# EasyEDA Pro project ProProject_Access Control Core_2024-06-07.epro, schematic V2.2.1 Schematic

## Sheets
1 Microcontroller: Create Date: 2024-05-24; Page Name: Microcontroller; Project Name: Access Control Core; Schematic Name: V2.2.1 Schematic; Update Date: 2024-06-07; Company: RIT SHED MAKERSPACE; Drawn: Jim Heaney; Page Size: A4; Part Number: JLCPCB-002; Reviewed: Jim Heaney; Version: V0.1
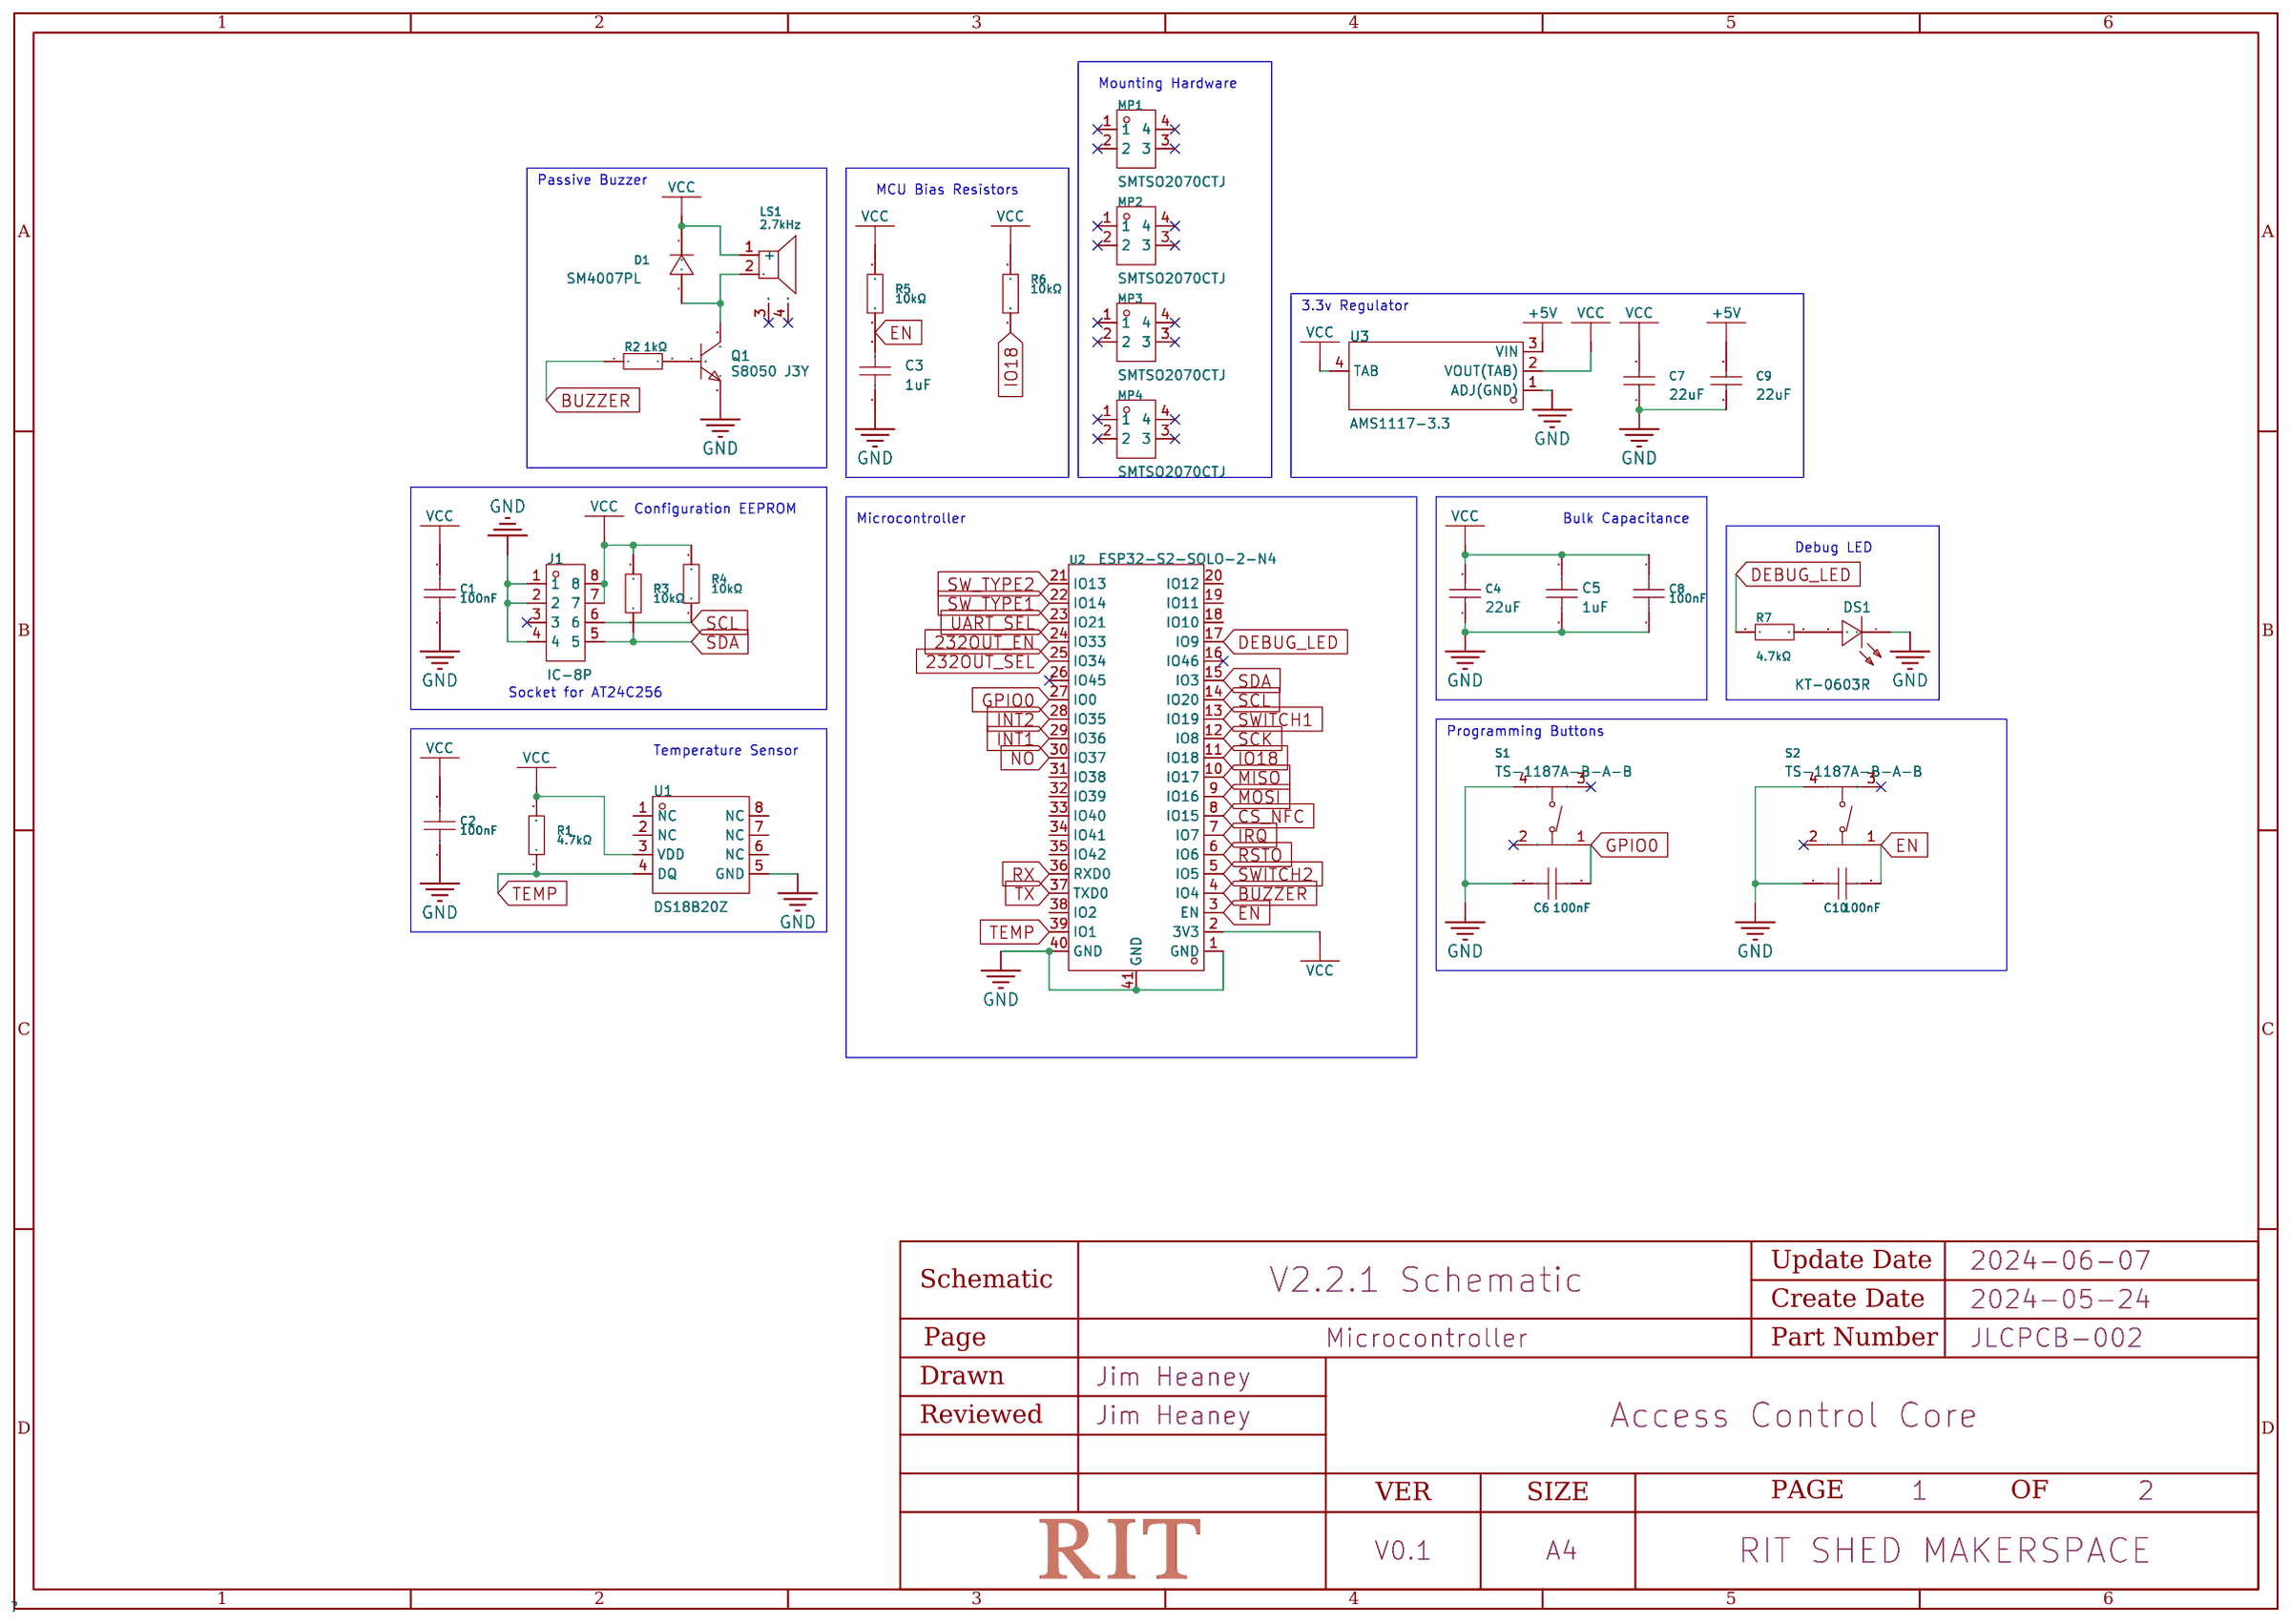
[diagram p7: Microcontroller]
2 Interface: Page Name: Interface
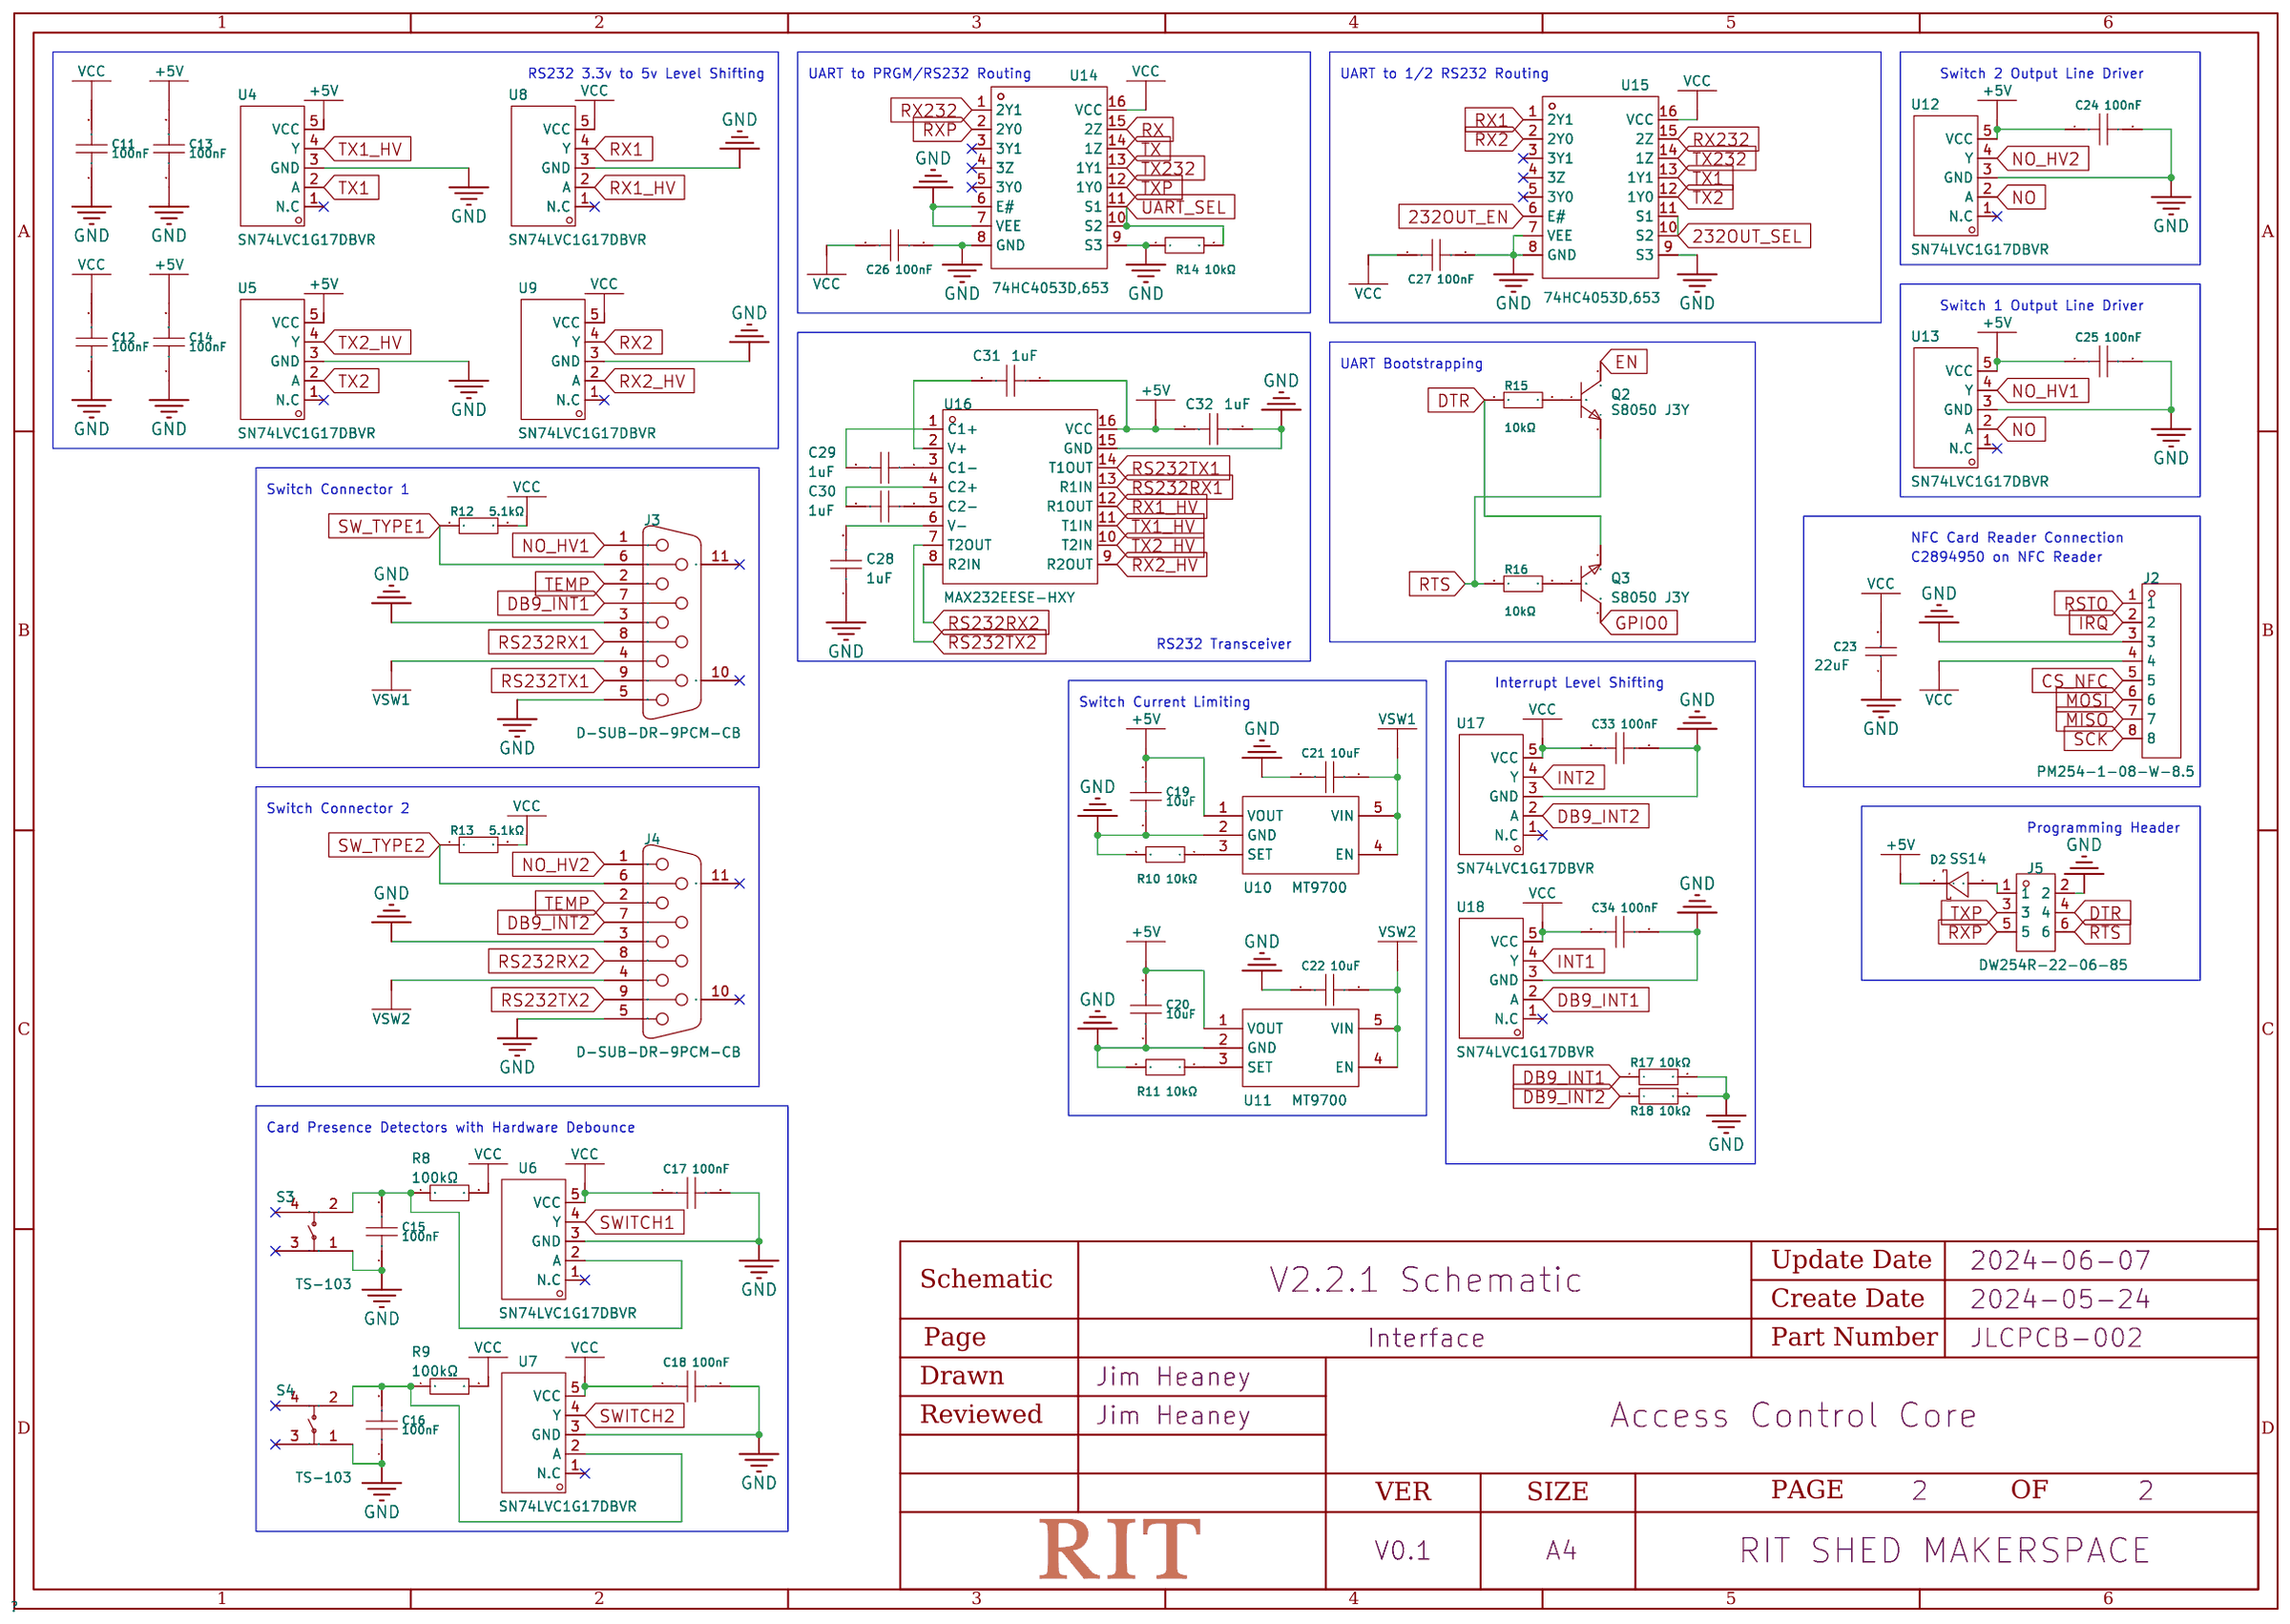
[diagram p8: Interface]

## Parts
sheet Interface
C11  100nF  [C0603]
C12  100nF  [C0603]
C13  100nF  [C0603]
C14  100nF  [C0603]
C15  100nF  [C0603]
C16  100nF  [C0603]
C17  100nF  [C0603]
C18  100nF  [C0603]
C19  10uF  [C0603]
C20  10uF  [C0603]
C21  10uF  [C0603]
C22  10uF  [C0603]
C23  22uF  [C1206]
C24  100nF  [C0603]
C25  100nF  [C0603]
C26  100nF  [C0603]
C27  100nF  [C0603]
C28  1uF  [C0603]
C29  1uF  [C0603]
C30  1uF  [C0603]
C31  1uF  [C0603]
C32  1uF  [C0603]
C33  100nF  [C0603]
C34  100nF  [C0603]
D2  SS14  [SMA_L4.2-W2.6-LS5.3-RD]
J2  PM254-1-08-W-8.5  [HDR-TH_8P-P2.54-H-F-W10.0-N]
J3  D-SUB-DR-9PCM-CB  [DB9-TH_ID09S33E4GV00LF]
J4  D-SUB-DR-9PCM-CB  [DB9-TH_ID09S33E4GV00LF]
J5  DW254R-22-06-85  [HDR-TH_6P-P2.54-V-F-R2-C3-S2.54]
Q2  S8050 J3Y  [SOT-23-3_L3.0-W1.7-P0.95-LS2.9-BR]
Q3  S8050 J3Y  [SOT-23-3_L3.0-W1.7-P0.95-LS2.9-BR]
R8  100kΩ  [R0603]
R9  100kΩ  [R0603]
R10  10kΩ  [R0603]
R11  10kΩ  [R0603]
R12  5.1kΩ  [R0603]
R13  5.1kΩ  [R0603]
R14  10kΩ  [R0603]
R15  10kΩ  [R0603]
R16  10kΩ  [R0603]
R17  10kΩ  [R0603]
R18  10kΩ  [R0603]
S3  TS-103  [SW-SMD_TS-103]
S4  TS-103  [SW-SMD_TS-103]
U4  SN74LVC1G17DBVR  [SOT-23-5_L3.0-W1.7-P0.95-LS2.8-BR]
U5  SN74LVC1G17DBVR  [SOT-23-5_L3.0-W1.7-P0.95-LS2.8-BR]
U6  SN74LVC1G17DBVR  [SOT-23-5_L3.0-W1.7-P0.95-LS2.8-BR]
U7  SN74LVC1G17DBVR  [SOT-23-5_L3.0-W1.7-P0.95-LS2.8-BR]
U8  SN74LVC1G17DBVR  [SOT-23-5_L3.0-W1.7-P0.95-LS2.8-BR]
U9  SN74LVC1G17DBVR  [SOT-23-5_L3.0-W1.7-P0.95-LS2.8-BR]
U10  MT9700  [SOT-23-5_L3.0-W1.7-P0.95-LS2.8-BR]
U11  MT9700  [SOT-23-5_L3.0-W1.7-P0.95-LS2.8-BR]
U12  SN74LVC1G17DBVR  [SOT-23-5_L3.0-W1.7-P0.95-LS2.8-BR]
U13  SN74LVC1G17DBVR  [SOT-23-5_L3.0-W1.7-P0.95-LS2.8-BR]
U14  74HC4053D,653  [SOIC-16_L9.9-W3.9-P1.27-LS6.0-BL]
U15  74HC4053D,653  [SOIC-16_L9.9-W3.9-P1.27-LS6.0-BL]
U16  MAX232EESE-HXY  [SOP-16_L9.9-W3.9-P1.27-LS6.0-BL]
U17  SN74LVC1G17DBVR  [SOT-23-5_L3.0-W1.7-P0.95-LS2.8-BR]
U18  SN74LVC1G17DBVR  [SOT-23-5_L3.0-W1.7-P0.95-LS2.8-BR]
sheet Microcontroller
C1  100nF  [C0603]
C2  100nF  [C0603]
C3  1uF  [C0603]
C4  22uF  [C1206]
C5  1uF  [C0603]
C6  100nF  [C0603]
C7  22uF  [C1206]
C8  100nF  [C0603]
C9  22uF  [C1206]
C10  100nF  [C0603]
D1  SM4007PL  [SOD-123F_L2.8-W1.8-LS3.7-RD]
DS1  KT-0603R  [LED0603-RD]
J1  IC-8P  [DIP-8_L10.2-W10.1-P2.54-LS7.6-BL]
LS1  2.7kHz  [BUZ-SMD_4P-L8.5-W8.5-P8.50-TL]
MP1  SMTSO2070CTJ  [SMD_BD5.6-L5.6-W5.6-D3.6]
MP2  SMTSO2070CTJ  [SMD_BD5.6-L5.6-W5.6-D3.6]
MP3  SMTSO2070CTJ  [SMD_BD5.6-L5.6-W5.6-D3.6]
MP4  SMTSO2070CTJ  [SMD_BD5.6-L5.6-W5.6-D3.6]
Q1  S8050 J3Y  [SOT-23-3_L3.0-W1.7-P0.95-LS2.9-BR]
R1  4.7kΩ  [R0603]
R2  1kΩ  [R0603]
R3  10kΩ  [R0603]
R4  10kΩ  [R0603]
R5  10kΩ  [R0603]
R6  10kΩ  [R0603]
R7  4.7kΩ  [R0603]
S1  TS-1187A-B-A-B  [SW-SMD_4P-L5.1-W5.1-P3.70-LS6.5-TL-2]
S2  TS-1187A-B-A-B  [SW-SMD_4P-L5.1-W5.1-P3.70-LS6.5-TL-2]
U1  DS18B20Z  [SOP-8_L4.9-W3.9-P1.27-LS6.0-BL]
U2  2.4GHz  [WIRELM-SMD_ESP32-S3-WROOM-1]
U3  AMS1117-3.3  [SOT-223-4_L6.5-W3.5-P2.30-LS7.0-BR]

## Library data of the parts
C1 C2 C6 C8 C10-C18 C24-C27 C33 C34 = CC0603KRX7R9BB104: Capacitance: Tolerance:±10% Tolerance:±10% Voltage Rated: Temperature Coefficient:; LCSC Part Name: 100nF ±10% 50V; Supplier Part: C14663; Manufacturer: YAGEO(国巨); Supplier Footprint: 0603; JLCPCB Part Class: Basic Part; Datasheet: https://atta.szlcsc.com/upload/public/pdf/source/20180910/C282072_33301C7F631E79921B82A8DAC6BCC5B3.pdf; Supplier: LCSC; Tolerance: ±10%
C19-C22 = CL10A106MA8NRNC: Capacitance: Tolerance:±20% Tolerance:±20% Voltage Rated: Temperature Coefficient:; LCSC Part Name: 10uF ±20% 25V; Supplier Part: C96446; Manufacturer: SAMSUNG(三星); Supplier Footprint: 0603; JLCPCB Part Class: Basic Part; Datasheet: https://atta.szlcsc.com/upload/public/pdf/source/20160218/1457707763339.pdf; Supplier: LCSC; Tolerance: ±20%
C4 C7 C9 C23 = CL31A226KAHNNNE: Capacitance: Tolerance:±10% Tolerance:±10% Voltage Rated: Temperature Coefficient:; LCSC Part Name: 22uF ±10% 25V; Supplier Part: C12891; Manufacturer: SAMSUNG(三星); Supplier Footprint: 1206; JLCPCB Part Class: Basic Part; Datasheet: https://atta.szlcsc.com/upload/public/pdf/source/20160218/1457707763339.pdf; Supplier: LCSC; Tolerance: ±10%
C3 C5 C28-C32 = CL10A105KB8NNNC: Capacitance: Tolerance:±10% Tolerance:±10% Voltage Rated: Temperature Coefficient:; LCSC Part Name: 1uF ±10% 50V; Supplier Part: C15849; Manufacturer: SAMSUNG(三星); Supplier Footprint: 0603; JLCPCB Part Class: Basic Part; Datasheet: https://atta.szlcsc.com/upload/public/pdf/source/20160218/1457707763339.pdf; Supplier: LCSC; Tolerance: ±10%
D2 = SS14_C2480: Diode Configuration:Single Forward Voltage (Vf@If):550mV@1A Reverse Voltage (Vr):40V Average Rectified Current (Io):1A Reverse Leakage Current (Ir):500uA@40V; LCSC Part Name: 电压:40V 电流:1A; Supplier Part: C2480; Manufacturer: MDD; Supplier Footprint: SMA(DO-214AC); JLCPCB Part Class: Basic Part; Datasheet: https://atta.szlcsc.com/upload/public/pdf/source/20230712/2DB6064CFBB99DE6DB116BEE8208BE66.pdf; Supplier: LCSC; Diode Configuration: Single; Forward Voltage (Vf@If): 550mV@1A; Reverse Voltage (Vr): 40V; Average Rectified Current (Io): 1A; Reverse Leakage Current (Ir): 500uA@40V
J2 = PM254-1-08-W-8.5: Holes Structure:1x8P Pitch:2.54mm Row Spacing:- Circular Hole / Square Hole:Square Holes Mounting Type:Right-Angle Number of Rows:Plugin Number of Holes:8P Current Rating (Max):3A Voltage Rating (Max):- Holes Direction:side Insulation Height:8.5mm Contact; LCSC Part Name: 1x8P 间距:2.54mm 弯插; Supplier Part: C2897390; Manufacturer: HCTL(华灿天禄); Supplier Footprint: 弯插,P=2.54mm; JLCPCB Part Class: Extended Part; Datasheet: https://atta.szlcsc.com/upload/public/pdf/source/20230609/7BA40A3D721268A082DCDEAD4C99131B.pdf; Supplier: LCSC; Holes Structure: 1x8P; Pitch: 2.54mm; Circular Hole / Square Hole: Square Holes; Mounting Type: Right-Angle; Number of Rows: Plugin; Number of Holes: 8P; Current Rating (Max): 3A; Holes Direction: side; Insulation Height: 8.5mm; Contact Material: Copper Alloy; Operating Temperature Range: -40℃~+105℃; Soldering Temperature(Max): 260℃@5S
J3 J4 = D-SUB-DR-9PCM-CB: Connector Type:D-Sub Gender:Female Number of Pins:9P Mounting Style:Right-Angle Number of Rows:2 Current Rating (Max):3A Contact Plating:Tin Operating Temperature Range:-50℃~+105℃ Operating Temperature Range:-50℃~+105℃; LCSC Part Name: D-Sub 母 P数:9P; Supplier Part: C19077337; Manufacturer: XUNPU(讯普); Supplier Footprint: 弯插; JLCPCB Part Class: Extended Part; Datasheet: https://atta.szlcsc.com/upload/public/pdf/source/20231108/FB2E8AB0BE4F620DDF3F7F4D0B9AFB97.pdf; Supplier: LCSC; Connector Type: D-Sub; Gender: Female; Number of Pins: 9P; Mounting Style: Right-Angle; Number of Rows: 2; Current Rating (Max): 3A; Contact Plating: Tin; Operating Temperature Range: -50℃~+105℃
J5 = DW254R-22-06-85: Holes Structure:2x3P Pitch:2.54mm Row Spacing:2.54mm Circular Hole / Square Hole:Square Holes Mounting Type:Straight Number of Rows:双排 Number of Holes:6P Current Rating (Max):3A Voltage Rating (Max):- Holes Direction:Top Insulation Height:8.5mm Operating; LCSC Part Name: 间距:2.54mm 2x3P 直插; Supplier Part: C2935983; Manufacturer: DEALON(德艺隆); Supplier Footprint: 插件,P=2.54mm; JLCPCB Part Class: Extended Part; Datasheet: https://atta.szlcsc.com/upload/public/pdf/source/20211231/BFA45F732C9356EE88FA0C9F09D83196.pdf; Supplier: LCSC; Holes Structure: 2x3P; Pitch: 2.54mm; Row Spacing: 2.54mm; Circular Hole / Square Hole: Square Holes; Mounting Type: Straight; Number of Rows: 双排; Number of Holes: 6P; Current Rating (Max): 3A; Holes Direction: Top; Insulation Height: 8.5mm
Q1-Q3 = S8050 J3Y_C2146: Transistor Type: Collector Current (Ic): Collector-Emitter Breakdown Voltage (Vceo): Power Dissipation (Pd): DC Current Gain (hFE@Ic,Vce):200@50mA,1V DC Current Gain (hFE@Ic,Vce):200@50mA,1V Transition Frequency (fT):150MHz Collector Cut-Off Current (Icbo; LCSC Part Name: S8050 J3Y(RANGE:200-350) H档(200-350); Supplier Part: C2146; Manufacturer: CJ(江苏长电/长晶); Supplier Footprint: SOT-23; JLCPCB Part Class: Basic Part; Datasheet: https://atta.szlcsc.com/upload/public/pdf/source/20140809/1457707209234.pdf; Supplier: LCSC; DC Current Gain (hFE@Ic,Vce): 200@50mA,1V; Transition Frequency (fT): 150MHz; Collector Cut-Off Current (Icbo): 100nA; Collector-Emitter Saturation Voltage (VCE(sat)@Ic,Ib): 600mV@500mA,50mA
R8 R9 = 0603WAF1003T5E: Type:Thick Film Resistors Resistance:100kΩ Tolerance:±1% Tolerance:±1% Power(Watts): Overload Voltage (Max): Temperature Coefficient:±100ppm/℃ Temperature Coefficient:±100ppm/℃ Operating Temperature Range:-55℃~+155℃ Operating Temperature Range:-55℃~+155℃; LCSC Part Name: 100kΩ ±1% 100mW 厚膜电阻; Supplier Part: C25803; Manufacturer: UNI-ROYAL(厚声); Supplier Footprint: 0603; JLCPCB Part Class: Basic Part; Datasheet: https://atta.szlcsc.com/upload/public/pdf/source/20200306/C422600_1E6D84923E4A46A82E41ADD87F860B5C.pdf; Supplier: LCSC; Type: Thick Film Resistors; Tolerance: ±1%; Temperature Coefficient: ±100ppm/℃; Operating Temperature Range: -55℃~+155℃
R3-R6 R10 R11 R14-R18 = 0603WAF1002T5E: Type:Thick Film Resistors Resistance:10kΩ Tolerance:±1% Tolerance:±1% Power(Watts): Overload Voltage (Max): Temperature Coefficient:±100ppm/℃ Temperature Coefficient:±100ppm/℃ Operating Temperature Range:-55℃~+155℃ Operating Temperature Range:-55℃~+155℃; LCSC Part Name: 厚膜电阻 10kΩ ±1% 100mW; Supplier Part: C25804; Manufacturer: UNI-ROYAL(厚声); Supplier Footprint: 0603; JLCPCB Part Class: Basic Part; Datasheet: https://atta.szlcsc.com/upload/public/pdf/source/20200306/C422600_1E6D84923E4A46A82E41ADD87F860B5C.pdf; Supplier: LCSC; Type: Thick Film Resistors; Tolerance: ±1%; Temperature Coefficient: ±100ppm/℃; Operating Temperature Range: -55℃~+155℃
R12 R13 = 0603WAF5101T5E: Type:Thick Film Resistors Resistance:5.1kΩ Tolerance:±1% Tolerance:±1% Power(Watts): Overload Voltage (Max): Temperature Coefficient:±100ppm/℃ Temperature Coefficient:±100ppm/℃ Operating Temperature Range:-55℃~+155℃ Operating Temperature Range:-55℃~+155℃; LCSC Part Name: 5.1kΩ ±1% 100mW 厚膜电阻; Supplier Part: C23186; Manufacturer: UNI-ROYAL(厚声); Supplier Footprint: 0603; JLCPCB Part Class: Basic Part; Datasheet: https://atta.szlcsc.com/upload/public/pdf/source/20200306/C422600_1E6D84923E4A46A82E41ADD87F860B5C.pdf; Supplier: LCSC; Type: Thick Film Resistors; Tolerance: ±1%; Temperature Coefficient: ±100ppm/℃; Operating Temperature Range: -55℃~+155℃
S3 S4 = TS-103: Type:Micro Switch Circuit:SPST Actuator Style:Corner flick Switch Length:4.75mm Switch Width:3.6mm Switch Height:3.75mm Contact Current (DC):50mA Voltage Rating (DC):12V Contact Current (AC):- Voltage Rating (AC):- Mechanical Life:10万次 Pin Style:- Operati; LCSC Part Name: 4.75*3.6*3.75mm 贴片微动开关; Supplier Part: C668592; Manufacturer: SHOU HAN(首韩); Supplier Footprint: SMD; JLCPCB Part Class: Extended Part; Datasheet: https://atta.szlcsc.com/upload/public/pdf/source/20200618/C668592_56C85AAF79E541D110C869AD77F2B956.pdf; Supplier: LCSC; Type: Micro Switch; Circuit: SPST; Actuator Style: Corner flick; Switch Length: 4.75mm; Switch Width: 3.6mm; Switch Height: 3.75mm; Contact Current (DC): 50mA; Voltage Rating (DC): 12V; Mechanical Life: 10万次; Operating Temperature: -30℃~+85℃
U4-U9 U12 U13 U17 U18 = SN74LVC1G17DBVR: Input type:Schmitt Trigger output type:推挽 Supply Voltage:1.65V~5.5V Supply Voltage:1.65V~5.5V Number of Elements:1 Number of Bits per Element:1 Sink Current:32mA Source Current:32mA Logic Family:74LVC Operating Temperature:-40℃~+125℃ Operating Temperature; Supplier Part: C7836; Manufacturer: TI(德州仪器); Supplier Footprint: SOT-23-5; JLCPCB Part Class: Extended Part; Datasheet: https://www.ti.com/cn/lit/gpn/sn74lvc1g17; Supplier: LCSC; Input type: Schmitt Trigger; output type: 推挽; Supply Voltage: 1.65V~5.5V; Number of Elements: 1; Number of Bits per Element: 1; Sink Current: 32mA; Source Current: 32mA; Logic Family: 74LVC; Operating Temperature: -40℃~+125℃
U10 U11 = MT9700: Supplier Part: C89855; Manufacturer: 西安航天民芯; Supplier Footprint: SOT-23-5; JLCPCB Part Class: Extended Part; Datasheet: https://atta.szlcsc.com/upload/public/pdf/source/20170418/1492481333031.pdf; Supplier: LCSC
U14 U15 = 74HC4053D,653: Switch Circuit:SPDT(SPDT) Number of Channels:3 Supply Voltage:2V~10V Supply Voltage:2V~10V Turn-on time:31ns On-State Resistance (Max):120Ω Turn-off time:29ns; Supplier Part: C5647; Manufacturer: Nexperia(安世); Supplier Footprint: SOIC-16; JLCPCB Part Class: Extended Part; Datasheet: https://atta.szlcsc.com/upload/public/pdf/source/20170918/C131090_1505726845374976183.pdf; Supplier: LCSC; Switch Circuit: SPDT(SPDT); Number of Channels: 3; Supply Voltage: 2V~10V; Turn-on time: 31ns; On-State Resistance (Max): 120Ω; Turn-off time: 29ns
U16 = MAX232EESE-HXY: Driver/receiver:2/2 Data Rate:120Kbps Data Rate:120Kbps Supply Voltage:5V Supply Voltage:5V; Supplier Part: C19626971; Manufacturer: HXY MOSFET(华轩阳电子); Supplier Footprint: SOP-16; JLCPCB Part Class: Extended Part; Datasheet: https://atta.szlcsc.com/upload/public/pdf/source/20231215/08C47B9710D348E23143C3CE5F7DFFF8.pdf; Supplier: LCSC; Driver/receiver: 2/2; Data Rate: 120Kbps; Supply Voltage: 5V
D1 = SM4007PL_C64898: Diode Configuration: Forward Voltage (Vf@If):1.1V@1A Reverse Voltage (Vr): Average Rectified Current (Io): Reverse Leakage Current:10uA@1kV; LCSC Part Name: 电压:1kV 电流:1A; Supplier Part: C64898; Manufacturer: MDD; Supplier Footprint: SOD-123FL; JLCPCB Part Class: Basic Part; Datasheet: https://atta.szlcsc.com/upload/public/pdf/source/20230823/16A8FDE162764C9B685A3717F2DA3690.pdf; Supplier: LCSC; Forward Voltage (Vf@If): 1.1V@1A; Reverse Leakage Current: 10uA@1kV
DS1 = KT-0603R: Emitted Color:Red Power Dissipation:- Forward Current:- Dominant Wavelength:- Dominant Wavelength:- Peak Wavelength:- Diode Configuration:- Lens Color:- Color Temperature:- Color Temperature:- Viewing Angle:- Mounting Sytle:- Operating Temperature:-40℃~+8; LCSC Part Name: 0603 红灯 高亮; Supplier Part: C2286; Manufacturer: KENTO; Supplier Footprint: 0603; JLCPCB Part Class: Basic Part; Datasheet: https://atta.szlcsc.com/upload/public/pdf/source/20160616/1466072038404.pdf; Supplier: LCSC; Emitted Color: Red; Operating Temperature: -40℃~+85℃
J1 = IC-8P: Number of Positions:8P; LCSC Part Name: P数:8P; Supplier Part: C5289485; Manufacturer: ZHOURI(洲日); Supplier Footprint: DIP-8; JLCPCB Part Class: Extended Part; Datasheet: https://atta.szlcsc.com/upload/public/pdf/source/20221125/3E83BD656FA58AC4D44626E20A8B2E8F.pdf; Supplier: LCSC; Number of Positions: 8P
LS1 = MLT-8540: Oscillator Circuit:无源(外部驱动) Technology Type:电磁式 Operating Voltage:2.5V~4.5V Operating Voltage:2.5V~4.5V Frequency:2.7kHz Current Consumption:- Sound Pressure Level (SPL):80dB@5V,10cm Diameter (φD):- Length:8.7mm Width:8.7mm Height:4mm Operating Temperatur; Supplier Part: C95300; Manufacturer: 华能; Supplier Footprint: SMD,8.7x8.7mm; JLCPCB Part Class: Extended Part; Datasheet: https://atta.szlcsc.com/upload/public/pdf/source/20170522/1495448323732.pdf; Supplier: LCSC; Oscillator Circuit: 无源(外部驱动); Technology Type: 电磁式; Operating Voltage: 2.5V~4.5V; Sound Pressure Level (SPL): 80dB@5V,10cm; Length: 8.7mm; Width: 8.7mm; Height: 4mm
MP1-MP4 = SMTSO2070CTJ: specifications:M2X7 surface treatment:镀锡 Product Description:- material quality:- model:SMTSO2070CTJ brand:Sinhoo(雄和远景); LCSC Part Name: 雄和远景，电路板表贴圆螺母柱，M2X7，铜镀锡,1个; Supplier Part: C2916355; Manufacturer: Sinhoo(雄和远景); JLCPCB Part Class: Extended Part; Datasheet: https://atta.szlcsc.com/upload/public/pdf/source/20211122/17CF5E24EB4D4DC090A80DE3D7DE5E21.pdf; Supplier: LCSC; specifications: M2X7; surface treatment: 镀锡; brand: Sinhoo(雄和远景)
R1 R7 = 0603WAF4701T5E: Type:Thick Film Resistors Resistance:4.7kΩ Tolerance:±1% Tolerance:±1% Power(Watts): Overload Voltage (Max): Temperature Coefficient:±100ppm/℃ Temperature Coefficient:±100ppm/℃ Operating Temperature Range:-55℃~+155℃ Operating Temperature Range:-55℃~+155℃; LCSC Part Name: 4.7kΩ ±1% 100mW 厚膜电阻; Supplier Part: C23162; Manufacturer: UNI-ROYAL(厚声); Supplier Footprint: 0603; JLCPCB Part Class: Basic Part; Datasheet: https://atta.szlcsc.com/upload/public/pdf/source/20200306/C422600_1E6D84923E4A46A82E41ADD87F860B5C.pdf; Supplier: LCSC; Type: Thick Film Resistors; Tolerance: ±1%; Temperature Coefficient: ±100ppm/℃; Operating Temperature Range: -55℃~+155℃
R2 = 0603WAF1001T5E: Type:Thick Film Resistors Resistance:1kΩ Tolerance:±1% Tolerance:±1% Power(Watts): Overload Voltage (Max): Temperature Coefficient:±100ppm/℃ Temperature Coefficient:±100ppm/℃ Operating Temperature Range:-55℃~+155℃ Operating Temperature Range:-55℃~+155℃; LCSC Part Name: 1kΩ ±1% 100mW 厚膜电阻; Supplier Part: C21190; Manufacturer: UNI-ROYAL(厚声); Supplier Footprint: 0603; JLCPCB Part Class: Basic Part; Datasheet: https://atta.szlcsc.com/upload/public/pdf/source/20200306/C422600_1E6D84923E4A46A82E41ADD87F860B5C.pdf; Supplier: LCSC; Type: Thick Film Resistors; Tolerance: ±1%; Temperature Coefficient: ±100ppm/℃; Operating Temperature Range: -55℃~+155℃
S1 S2 = TS-1187A-B-A-B: Circuit:SPST Actuator Style:Round Button Operating Force:160gf Mounting Style:Brick nogging Switch Length:5.1mm Switch Width:5.1mm Switch Height:1.5mm Strike Gundam:不带 Contact Current:50mA Voltage Rating (DC):12V Insulation Resistance:- Actuator/Cap Color; LCSC Part Name: 5.1*5.1*1.5mm 立贴 轻触开关; Supplier Part: C318884; Manufacturer: XKB Connectivity(中国星坤); Supplier Footprint: SMD; JLCPCB Part Class: Basic Part; Datasheet: https://atta.szlcsc.com/upload/public/pdf/source/20200227/C318890_053E50208A88A7BA1965D8746000774E.pdf; Supplier: LCSC; Circuit: SPST; Actuator Style: Round Button; Operating Force: 160gf; Mounting Style: Brick nogging; Switch Length: 5.1mm; Switch Width: 5.1mm; Switch Height: 1.5mm; Strike Gundam: 不带; Contact Current: 50mA; Voltage Rating (DC): 12V; Actuator/Cap Color: 金色; With Lamp: No; Mechanical Life: 10万次; Operating Temperature: -30℃~+85℃
U1 = DS18B20Z: Resolution:±0.4℃ Resolution:±0.4℃ Supply Voltage:2.5V~5.5V Supply Voltage:2.5V~5.5V; LCSC Part Name: 温度传感器; Supplier Part: C695837; Manufacturer: UMW(友台半导体); Supplier Footprint: SOIC-8; JLCPCB Part Class: Extended Part; Datasheet: https://atta.szlcsc.com/upload/public/pdf/source/20231109/DC3DA9D47D486EF40A6E0F08B9A498E3.pdf; Supplier: LCSC; Resolution: ±0.4℃; Supply Voltage: 2.5V~5.5V
U2 = ESP32-S2-SOLO-2-N4: Core Processor:ESP32-S2芯片 Support Interface:I2C；GPIO；SPI；PWM；ADC；UART；USB；I2S Frequency:2.4GHz Output Power:19.5dBm Output Power:19.5dBm; Supplier Part: C3040594; Manufacturer: ESPRESSIF(乐鑫); Supplier Footprint: SMD-41P; JLCPCB Part Class: Extended Part; Datasheet: https://atta.szlcsc.com/upload/public/pdf/source/20220829/68E69EF550BFD22B9418B9E05FF4E453.pdf; Supplier: LCSC; Core Processor: ESP32-S2芯片; Support Interface: I2C；GPIO；SPI；PWM；ADC；UART；USB；I2S; Output Power: 19.5dBm
U3 = AMS1117-3.3_C347222: Output Type: Maximum Input Voltage:12V Output Voltage:3.3V Output Voltage:3.3V MAX Output Current:1A Power Supply Rejection Ratio (PSRR):60dB@(120Hz) Dropout Voltage:1.3V@(1A) standby current:- Noise:- Feature:- Operating Temperature:- Operating Temperatu; LCSC Part Name: 输出:3.3V 电流:1A 耐压:12V; Supplier Part: C347222; Manufacturer: UMW(友台半导体); Supplier Footprint: SOT-223; JLCPCB Part Class: Extended Part; Datasheet: https://atta.szlcsc.com/upload/public/pdf/source/20231109/155D79A26D9DB04352555A58D5969DC8.pdf; Supplier: LCSC; Maximum Input Voltage: 12V; Output Voltage: 3.3V; MAX Output Current: 1A; Power Supply Rejection Ratio (PSRR): 60dB@(120Hz); Dropout Voltage: 1.3V@(1A); Output Polarity: Positive electrode; Number of Outputs: 1

## Nets
+5V: C9.2 C13.2 C14.2 C19.2 C20.2 C24.1 C25.1 C31.1 C32.2 D2.1(K) U3.3(VIN) U4.5(VCC) U5.5(VCC) U10.1(VOUT) U11.1(VOUT) U12.5(VCC) U13.5(VCC) U16.16(VCC)
GND: C1.1 C2.1 C3.1 C4.1 C5.1 C6.1 C7.1 C8.1 C9.1 C10.1 C11.1 C12.1 C13.1 C14.1 C15.1 C16.1 C17.2 C18.2 C19.1 C20.1 C21.2 C22.2 C23.1 C24.2 C25.2 C26.2 C27.2 C28.1 C32.1 C33.1 C34.1 DS1.1(K) J1.1 J1.2 J1.4 J2.3 J3.3 J3.5 J4.3 J4.5 J5.2 Q1.2(E) R10.2 R11.2 R14.1 R17.2 R18.2 S1.4(D) S2.4(D) S3.1 S4.1 U1.5(GND) U2.1(GND) U2.40(GND) U2.41(GND) U3.1(ADJ(GND)) U4.3(GND) U5.3(GND) U6.3(GND) U7.3(GND) U8.3(GND) U9.3(GND) U10.2(GND) U11.2(GND) U12.3(GND) U13.3(GND) U14.6(E#) U14.7(VEE) U14.8(GND) U14.9(S3) U15.7(VEE) U15.8(GND) U15.9(S3) U16.15(GND) U17.3(GND) U18.3(GND)
VCC: C1.2 C2.2 C4.2 C5.2 C7.2 C8.2 C11.2 C12.2 C17.1 C18.1 C23.2 C26.1 C27.1 C33.2 C34.2 D1.1(C) J1.7 J1.8 J2.4 LS1.1(+) R1.2 R3.2 R4.2 R5.2 R6.2 R8.2 R9.2 R12.2 R13.2 U1.3(VDD) U2.2(3V3) U3.2(VOUT(TAB)) U3.4(TAB) U6.5(VCC) U7.5(VCC) U8.5(VCC) U9.5(VCC) U14.16(VCC) U15.16(VCC) U17.5(VCC) U18.5(VCC)
232OUT_EN: U2.24(IO33) U15.6(E#)
232OUT_SEL: U2.25(IO34) U15.10(S2) U15.11(S1)
BUZZER: R2.1 U2.4(IO4)
CS_NFC: J2.5 U2.8(IO15)
DB9_INT1: J3.7 R17.1 U18.2(A)
DB9_INT2: J4.7 R18.1 U17.2(A)
DEBUG_LED: R7.2 U2.17(IO9)
DTR: J5.4 Q3.2(E) R15.1
EN: C3.2 C10.2 Q2.3(C) R5.1 S2.1(A) U2.3(EN)
GPIO0: C6.2 Q3.3(C) S1.1(A) U2.27(IO0)
INT1: U2.29(IO36) U18.4(Y)
INT2: U2.28(IO35) U17.4(Y)
IO18: R6.1 U2.11(IO18)
IRQ: J2.2 U2.7(IO7)
MISO: J2.7 U2.10(IO17)
MOSI: J2.6 U2.9(IO16)
NO: U2.30(IO37) U12.2(A) U13.2(A)
NO_HV1: J3.1 U13.4(Y)
NO_HV2: J4.1 U12.4(Y)
RS232RX1: J3.8 U16.13(R1IN)
RS232RX2: J4.8 U16.8(R2IN)
RS232TX1: J3.9 U16.14(T1OUT)
RS232TX2: J4.9 U16.7(T2OUT)
RSTO: J2.1 U2.6(IO6)
RTS: J5.6 Q2.2(E) R16.1
RX: U2.36(RXD0) U14.15(2Z)
RX1: U8.4(Y) U15.1(2Y1)
RX1_HV: U8.2(A) U16.12(R1OUT)
RX2: U9.4(Y) U15.2(2Y0)
RX2_HV: U9.2(A) U16.9(R2OUT)
RX232: U14.1(2Y1) U15.15(2Z)
RXP: J5.5 U14.2(2Y0)
SCK: J2.8 U2.12(IO8)
SCL: J1.6 R4.1 U2.14(IO20)
SDA: J1.5 R3.1 U2.15(IO3)
SW_TYPE1: J3.6 R12.1 U2.22(IO14)
SW_TYPE2: J4.6 R13.1 U2.21(IO13)
SWITCH1: U2.13(IO19) U6.4(Y)
SWITCH2: U2.5(IO5) U7.4(Y)
TEMP: J3.2 J4.2 R1.1 U1.4(DQ) U2.39(IO1)
TX: U2.37(TXD0) U14.14(1Z)
TX1: U4.2(A) U15.13(1Y1)
TX1_HV: U4.4(Y) U16.11(T1IN)
TX2: U5.2(A) U15.12(1Y0)
TX2_HV: U5.4(Y) U16.10(T2IN)
TX232: U14.13(1Y1) U15.14(1Z)
TXP: J5.3 U14.12(1Y0)
UART_SEL: R14.2 U2.23(IO21) U14.10(S2) U14.11(S1)
VSW1: C21.1 J3.4 U10.4(EN) U10.5(VIN)
VSW2: C22.1 J4.4 U11.4(EN) U11.5(VIN)
$1N5366: Q1.1(B) R2.2
$1N5377: D1.2(A) LS1.2 Q1.3(C)
$1N8540: DS1.2(A) R7.1
$3N10824: C16.2 R9.1 S4.2 U7.2(A)
$3N11380: C15.2 R8.1 S3.2 U6.2(A)
$3N11664: R10.1 U10.3(SET)
$3N11721: R11.1 U11.3(SET)
$3N12960: C28.2 U16.6(V-)
$3N12975: C30.1 U16.5(C2-)
$3N13045: C31.2 U16.2(V+)
$3N13107: C30.2 U16.4(C2+)
$3N13146: C29.1 U16.3(C1-)
$3N13150: C29.2 U16.1(C1+)
$3N20206: Q3.1(B) R16.2
$3N20207: Q2.1(B) R15.2
$3N20460: D2.2(A) J5.1

Not connected (* = marked no-connect by the designer): J1 3*; J3 10(MH1)* 11(MH2)*; J4 10(MH1)* 11(MH2)*; LS1 3(NC)* 4(NC)*; MP1 1* 2* 3* 4*; MP2 1* 2* 3* 4*; MP3 1* 2* 3* 4*; MP4 1* 2* 3* 4*; S1 2(B)* 3(C)*; S2 2(B)* 3(C)*; S3 3* 4*; S4 3* 4*; U1 1(NC) 2(NC) 6(NC) 7(NC) 8(NC); U2 16(IO46)* 18(IO10) 19(IO11) 20(IO12) 26(IO45)* 31(IO38) 32(IO39) 33(IO40) 34(IO41) 35(IO42) 38(IO2); U4 1(N.C)*; U5 1(N.C)*; U6 1(N.C)*; U7 1(N.C)*; U8 1(N.C)*; U9 1(N.C)*; U12 1(N.C)*; U13 1(N.C)*; U14 3(3Y1)* 4(3Z)* 5(3Y0)*; U15 3(3Y1)* 4(3Z)* 5(3Y0)*; U17 1(N.C)*; U18 1(N.C)*

## Notes on the sheets
sheet 1
- Mounting Hardware
- Passive Buzzer
- MCU Bias Resistors
- 3.3v Regulator
- Configuration EEPROM
- Microcontroller
- Bulk Capacitance
- Debug LED
- Socket for AT24C256
- Programming Buttons
- Temperature Sensor
sheet 2
- RS232 3.3v to 5v Level Shifting
- UART to PRGM/RS232 Routing
- UART to 1/2 RS232 Routing
- Switch 2 Output Line Driver
- Switch 1 Output Line Driver
- UART Bootstrapping
- Switch Connector 1
- NFC Card Reader Connection
- C2894950 on NFC Reader
- RS232 Transceiver
- Switch Current Limiting
- Interrupt Level Shifting
- Switch Connector 2
- Programming Header
- Card Presence Detectors with Hardware Debounce
